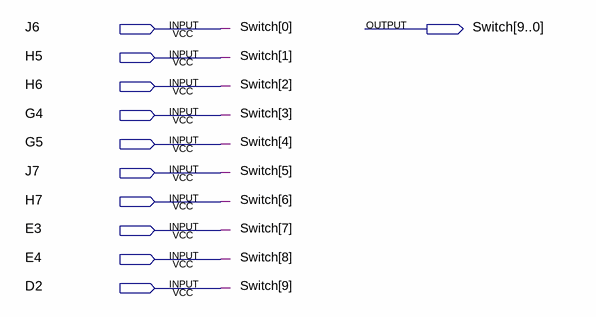
[diagram p0: schematic sheet]
// Quartus schematic Switch.bdf as structural Verilog: 0 symbols, 11 pins
module Switch (
  input  J6,
  input  H5,
  input  H6,
  input  G4,
  input  G5,
  input  J7,
  input  H7,
  input  E3,
  input  E4,
  input  D2,
  output [9:0] Switch
);


  assign Switch = {D2, E4, E3, H7, J7, G5, G4, H6, H5, J6};
endmodule
